# Altium schematic sheet Nixie Tubes.SchDoc: Nixie Tubes
size A4; Author: Ayesha Ebrahim; DrawnBy: Ayesha Ebrahim
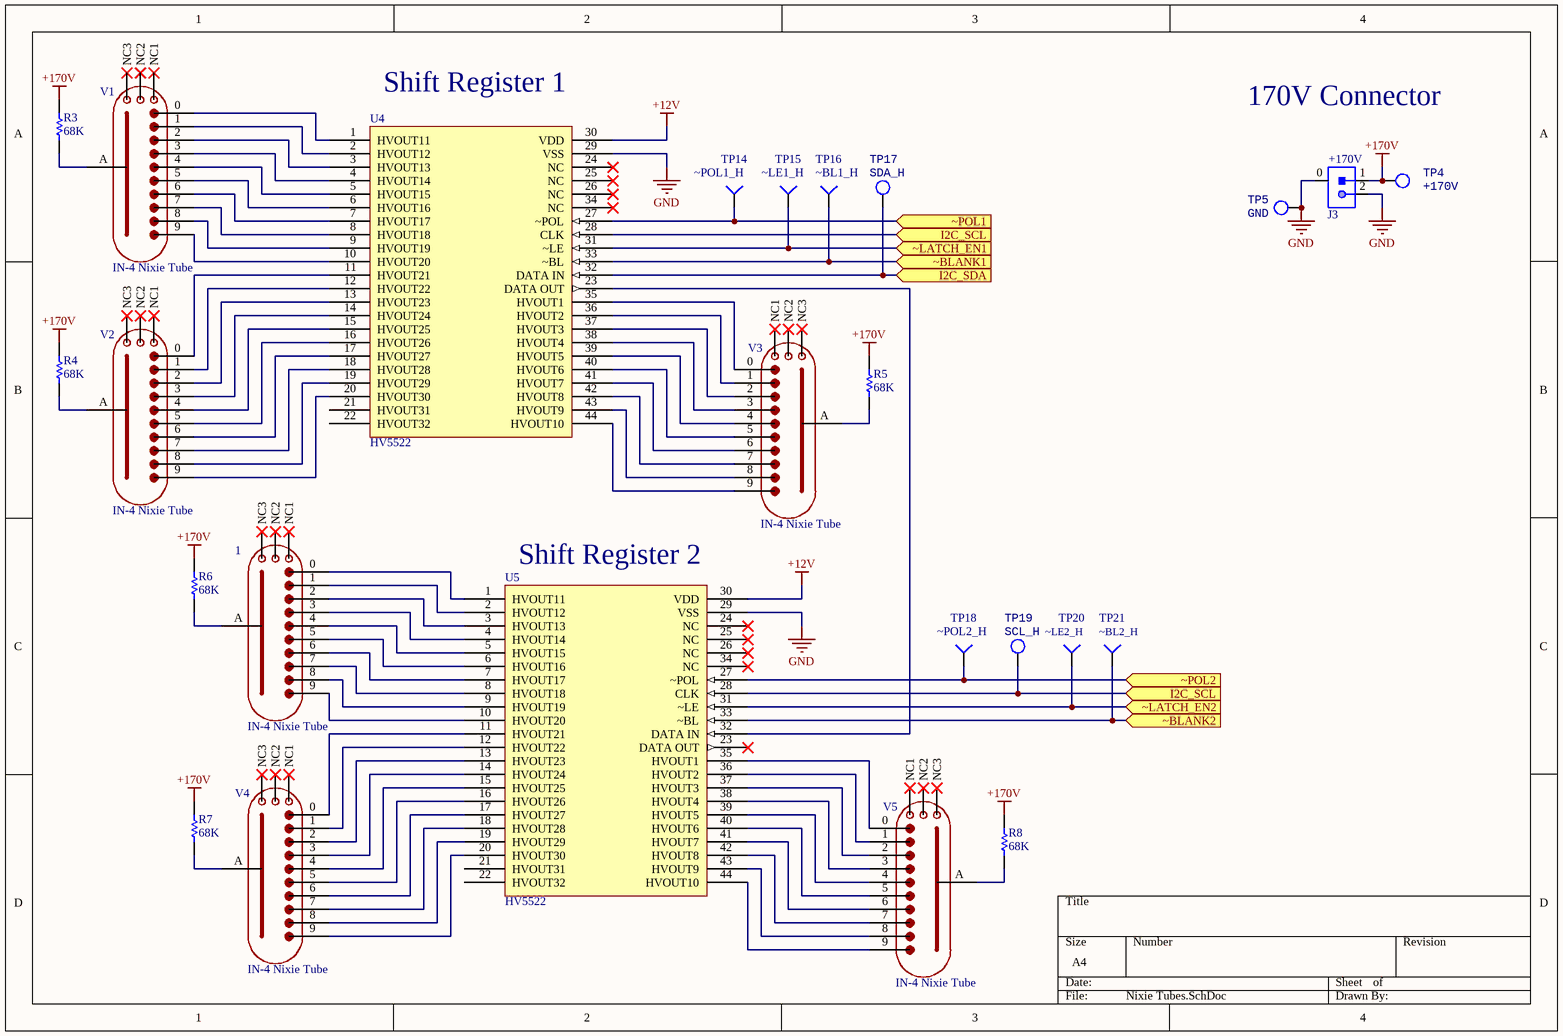
[diagram p0: Nixie Tubes.SchDoc]

## Parts
1  IN-4 Nixie Tube
J3  +170V  [MOLEX-5024940270]
R3  value 68K  [RESC3225X60N]  (hidden comment: RES_68K_1210)
R4  value 68K  [RESC3225X60N]  (hidden comment: RES_68K_1210)
R5  value 68K  [RESC3225X60N]  (hidden comment: RES_68K_1210)
R6  value 68K  [RESC3225X60N]  (hidden comment: RES_68K_1210)
R7  value 68K  [RESC3225X60N]  (hidden comment: RES_68K_1210)
R8  value 68K  [RESC3225X60N]  (hidden comment: RES_68K_1210)
TP4  +170V  [TESTPOINT_LOOP]
TP5  GND  [TESTPOINT_LOOP]
TP14  ~POL1_H  [TESTPOINT]
TP15  ~LE1_H  [TESTPOINT]
TP16  ~BL1_H  [TESTPOINT]
TP17  SDA_H  [TESTPOINT_LOOP]
TP18  ~POL2_H  [TESTPOINT]
TP19  SCL_H  [TESTPOINT_LOOP]
TP20  ~LE2_H  [TESTPOINT]
TP21  ~BL2_H  [TESTPOINT]
U4  HV5522  [*QFP80P1320X1320X270-44N]
U5  HV5522  [*QFP80P1320X1320X270-44N]
V1  IN-4 Nixie Tube  [IN-4]
V2  IN-4 Nixie Tube
V3  IN-4 Nixie Tube
V4  IN-4 Nixie Tube
V5  IN-4 Nixie Tube

## Ports
I2C_SCL (in), I2C_SDA (in), ~BLANK1 (in), ~BLANK2 (in), ~LATCH_EN1 (in), ~LATCH_EN2 (in), ~POL1 (in), ~POL2 (in)

## Nets
+12V: U4.30(VDD) U5.30(VDD)
+170V: J3.1 R3.2 R4.2 R5.2 R6.2 R7.2 R8.2 TP4.1
GND: J3.0 J3.2 TP5.1 U4.29(VSS) U5.29(VSS)
I2C_SCL: TP19.1 U4.28(CLK) U5.28(CLK) ; port I2C_SCL
I2C_SDA: TP17.1 U4.32(DATA_IN) ; port I2C_SDA
~BLANK1: TP16.1(=value) U4.33(~BL) ; port ~BLANK1
~BLANK2: TP21.1(=value) U5.33(~BL) ; port ~BLANK2
~LATCH_EN1: TP15.1(=value) U4.31(~LE) ; port ~LATCH_EN1
~LATCH_EN2: TP20.1(=value) U5.31(~LE) ; port ~LATCH_EN2
~POL1: TP14.1(=value) U4.27(~POL) ; port ~POL1
~POL2: TP18.1(=value) U5.27(~POL) ; port ~POL2
NetU4_23: U4.23(DATA_OUT) U5.32(DATA_IN)

Not connected (* = marked no-connect by the designer): 1 0(P8) 1 2 3 4 5 6 7 8 9 10(NC1) 11(NC2) 12(NC3) A; R3 1; R4 1; R5 1; R6 1; R7 1; R8 1; U4 1(HVOUT11) 2(HVOUT12) 3(HVOUT13) 4(HVOUT14) 5(HVOUT15) 6(HVOUT16) 7(HVOUT17) 8(HVOUT18) 9(HVOUT19) 10(HVOUT20) 11(HVOUT21) 12(HVOUT22) 13(HVOUT23) 14(HVOUT24) 15(HVOUT25) 16(HVOUT26) 17(HVOUT27) 18(HVOUT28) 19(HVOUT29) 20(HVOUT30) 21(HVOUT31) 22(HVOUT32) 24(NC)* 25(NC)* 26(NC)* 34(NC)* 35(HVOUT1) 36(HVOUT2) 37(HVOUT3) 38(HVOUT4) 39(HVOUT5) 40(HVOUT6) 41(HVOUT7) 42(HVOUT8) 43(HVOUT9) 44(HVOUT10); U5 1(HVOUT11) 2(HVOUT12) 3(HVOUT13) 4(HVOUT14) 5(HVOUT15) 6(HVOUT16) 7(HVOUT17) 8(HVOUT18) 9(HVOUT19) 10(HVOUT20) 11(HVOUT21) 12(HVOUT22) 13(HVOUT23) 14(HVOUT24) 15(HVOUT25) 16(HVOUT26) 17(HVOUT27) 18(HVOUT28) 19(HVOUT29) 20(HVOUT30) 21(HVOUT31) 22(HVOUT32) 23(DATA_OUT)* 24(NC)* 25(NC)* 26(NC)* 34(NC)* 35(HVOUT1) 36(HVOUT2) 37(HVOUT3) 38(HVOUT4) 39(HVOUT5) 40(HVOUT6) 41(HVOUT7) 42(HVOUT8) 43(HVOUT9) 44(HVOUT10); V1 0(P8) 1 2 3 4 5 6 7 8 9 10(NC1) 11(NC2) 12(NC3) A; V2 0(P8) 1 2 3 4 5 6 7 8 9 10(NC1) 11(NC2) 12(NC3) A; V3 0(P8) 1 2 3 4 5 6 7 8 9 10(NC1) 11(NC2) 12(NC3) A; V4 0(P8) 1 2 3 4 5 6 7 8 9 10(NC1) 11(NC2) 12(NC3) A; V5 0(P8) 1 2 3 4 5 6 7 8 9 10(NC1) 11(NC2) 12(NC3) A

## Notes on the sheet
- (near U4) Shift Register 1
- 170V Connector
- (near U5) Shift Register 2

## Library data of the parts
J3 = CON_2M_SM_RA: CONN HEADER SMD RIGHT ANGLE 2MM PITCH; Manufacturer 1: Molex; Manufacturer Part Number 1: 5024940270; Connector Type: Receptacle,Forked; Number of Positions: 2; Supplier 1: Digi-Key; Stock 1: 3397; Pricing 1: 1=0.53000, 10=0.49400, 25=0.44440, 50=0.39500, 100=0.37850, 250=0.34556 (USD); RoHS: No; Mount: Surface Mount; Contact Plating: Tin; Insulation Color: Natural; Insulation Material: Resin; Min Operating Temperature: -40°C; Max Operating Temperature: 105°C; Fastening Type: Latch; Packaging: Tape and Reel; Number of Rows: 1; Termination: Solder; Flammability Rating: UL94 V-0; ComponentLink1URL: https://www.molex.com/pdm_docs/as/AS-502439-002-001.pdf?src-supplier=Digi-Key; ComponentLink1Description: https://www.molex.com/pdm_docs/as/AS-502439-002-001.pdf?src-supplier=Digi-Key; Supplier Part Number 1: WM15810CT-ND
R3-R8 = RES_68K_1210: RES SMD 68K OHM 1% 0.75W 1210; Manufacturer 1: TE Connectivity Passive Product; Manufacturer Part Number 1: CRGP1210F68K; Package: 1210; Tolerance: 1%; Supplier Part Number 1: A130621CT-ND; Supplier 1: Digi-Key; Mount: Surface Mount
TP4 TP5 TP17 TP19 = TESTPOINT_LOOP: Loop testpoint through-hole pad; Manufacturer 1: Keystone Electronics; Manufacturer Part Number 1: 5002; Supplier Part Number 1: 36-5002-ND; Supplier 1: Digi-Key; Mount: Through Hole
TP14-TP16 TP18 TP20 TP21 = TESTPOINT_SMD: Part Number (MPN): *
U4 U5 = HV5522: IC 32BIT SRL CMOS 220V 44QFP; Shift Shift Register 1 Element 32 Bit 44-PQFP (10x10); Manufacturer 1: Microchip Technology; Manufacturer Part Number 1: HV5522PG-G; Supplier 1: Digi-Key; Supplier Part Number 1: HV5522PG-G-ND